# EasyEDA schematic SCH_Breadboard_2022-07-15.json
TITLE: Sheet_1; REV: 1.0; Date: 2022-07-15; Sheet: 1/1; Drawn By: limchengwei; Company: Your Company
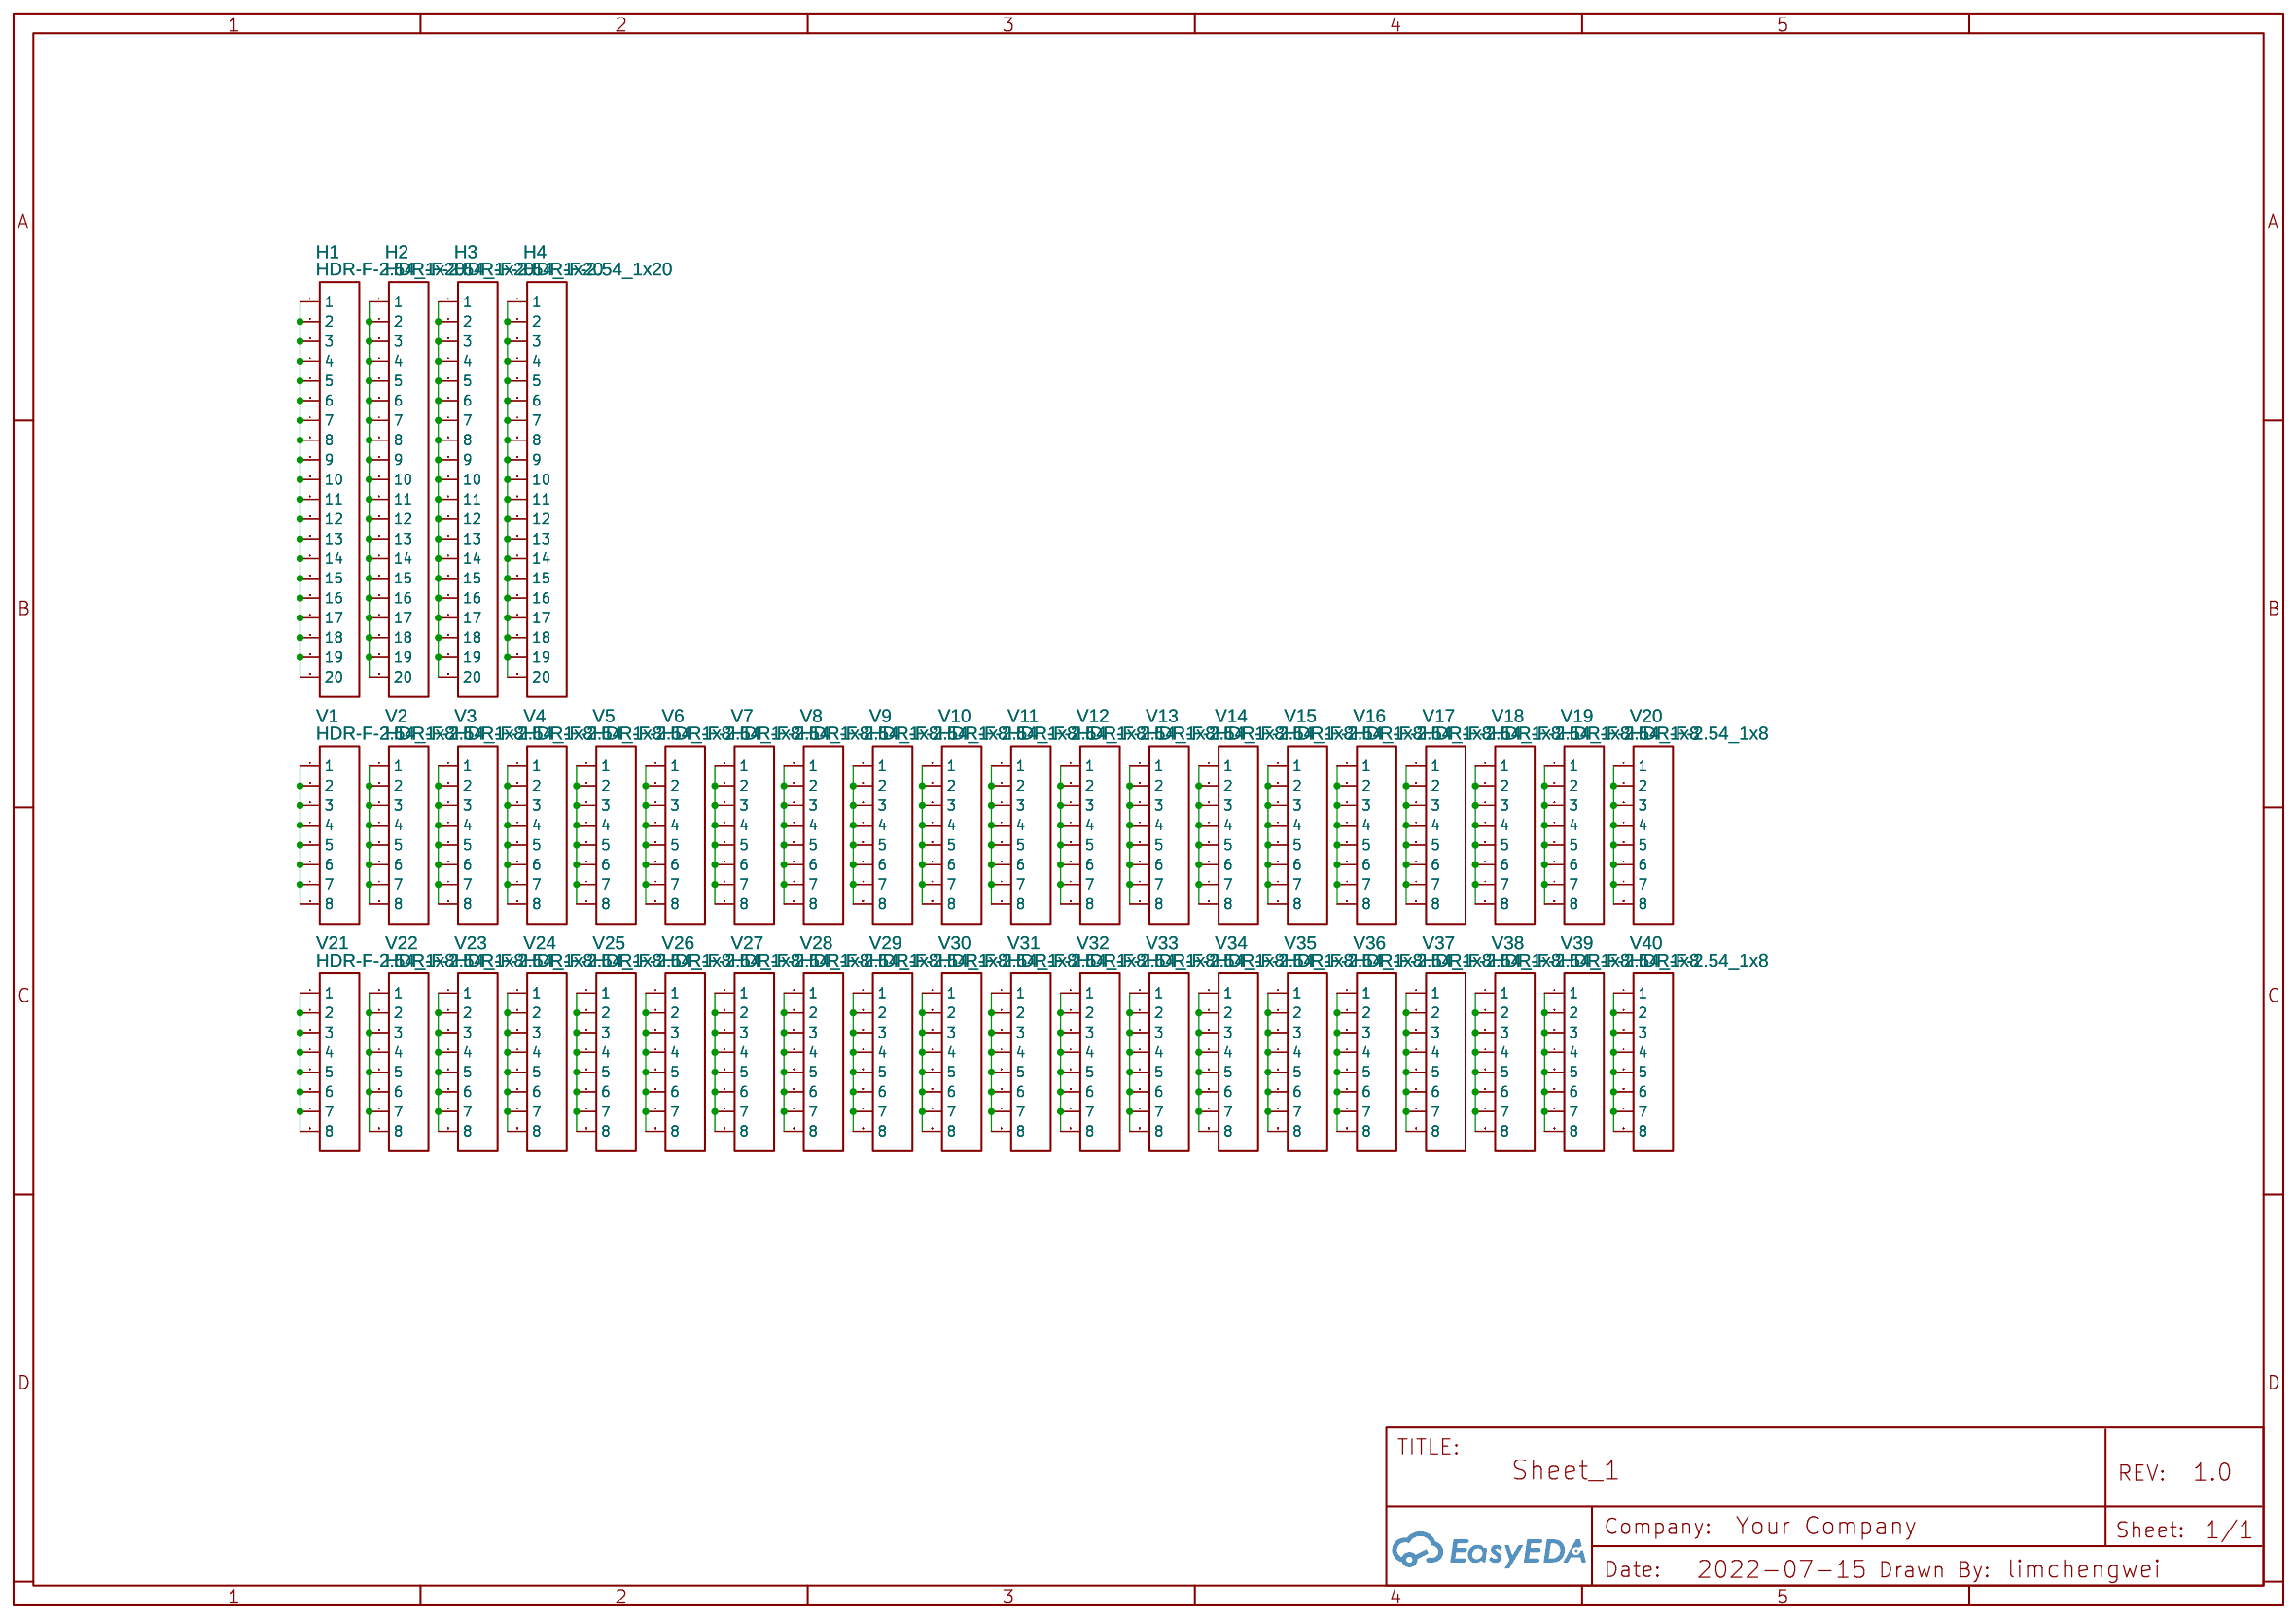
[diagram p0: schematic sheet]

## Parts
H1  HDR-F-2.54_1x20  [HDR-F-2.54_1X20]
H2  HDR-F-2.54_1x20  [HDR-F-2.54_1X20]
H3  HDR-F-2.54_1x20  [HDR-F-2.54_1X20]
H4  HDR-F-2.54_1x20  [HDR-F-2.54_1X20]
V1  HDR-F-2.54_1x8  [HDR-F-2.54_1X8]
V2  HDR-F-2.54_1x8  [HDR-F-2.54_1X8]
V3  HDR-F-2.54_1x8  [HDR-F-2.54_1X8]
V4  HDR-F-2.54_1x8  [HDR-F-2.54_1X8]
V5  HDR-F-2.54_1x8  [HDR-F-2.54_1X8]
V6  HDR-F-2.54_1x8  [HDR-F-2.54_1X8]
V7  HDR-F-2.54_1x8  [HDR-F-2.54_1X8]
V8  HDR-F-2.54_1x8  [HDR-F-2.54_1X8]
V9  HDR-F-2.54_1x8  [HDR-F-2.54_1X8]
V10  HDR-F-2.54_1x8  [HDR-F-2.54_1X8]
V11  HDR-F-2.54_1x8  [HDR-F-2.54_1X8]
V12  HDR-F-2.54_1x8  [HDR-F-2.54_1X8]
V13  HDR-F-2.54_1x8  [HDR-F-2.54_1X8]
V14  HDR-F-2.54_1x8  [HDR-F-2.54_1X8]
V15  HDR-F-2.54_1x8  [HDR-F-2.54_1X8]
V16  HDR-F-2.54_1x8  [HDR-F-2.54_1X8]
V17  HDR-F-2.54_1x8  [HDR-F-2.54_1X8]
V18  HDR-F-2.54_1x8  [HDR-F-2.54_1X8]
V19  HDR-F-2.54_1x8  [HDR-F-2.54_1X8]
V20  HDR-F-2.54_1x8  [HDR-F-2.54_1X8]
V21  HDR-F-2.54_1x8  [HDR-F-2.54_1X8]
V22  HDR-F-2.54_1x8  [HDR-F-2.54_1X8]
V23  HDR-F-2.54_1x8  [HDR-F-2.54_1X8]
V24  HDR-F-2.54_1x8  [HDR-F-2.54_1X8]
V25  HDR-F-2.54_1x8  [HDR-F-2.54_1X8]
V26  HDR-F-2.54_1x8  [HDR-F-2.54_1X8]
V27  HDR-F-2.54_1x8  [HDR-F-2.54_1X8]
V28  HDR-F-2.54_1x8  [HDR-F-2.54_1X8]
V29  HDR-F-2.54_1x8  [HDR-F-2.54_1X8]
V30  HDR-F-2.54_1x8  [HDR-F-2.54_1X8]
V31  HDR-F-2.54_1x8  [HDR-F-2.54_1X8]
V32  HDR-F-2.54_1x8  [HDR-F-2.54_1X8]
V33  HDR-F-2.54_1x8  [HDR-F-2.54_1X8]
V34  HDR-F-2.54_1x8  [HDR-F-2.54_1X8]
V35  HDR-F-2.54_1x8  [HDR-F-2.54_1X8]
V36  HDR-F-2.54_1x8  [HDR-F-2.54_1X8]
V37  HDR-F-2.54_1x8  [HDR-F-2.54_1X8]
V38  HDR-F-2.54_1x8  [HDR-F-2.54_1X8]
V39  HDR-F-2.54_1x8  [HDR-F-2.54_1X8]
V40  HDR-F-2.54_1x8  [HDR-F-2.54_1X8]

## Library data of the parts
H1-H4 = HDR-F-2.54_1x20: Supplier Part: C50984; Supplier: LCSC; Contributor: LCEDA_Lib
V1-V40 = HDR-F-2.54_1x8: Supplier Part: C225505; Supplier: LCSC; Contributor: LCEDA_Lib

## Nets
Net-(H1-1): H1.1 H1.2 H1.3 H1.4 H1.5 H1.6 H1.7 H1.8 H1.9 H1.10 H1.11 H1.12 H1.13 H1.14 H1.15 H1.16 H1.17 H1.18 H1.19 H1.20
Net-(H2-1): H2.1 H2.2 H2.3 H2.4 H2.5 H2.6 H2.7 H2.8 H2.9 H2.10 H2.11 H2.12 H2.13 H2.14 H2.15 H2.16 H2.17 H2.18 H2.19 H2.20
Net-(H3-1): H3.1 H3.2 H3.3 H3.4 H3.5 H3.6 H3.7 H3.8 H3.9 H3.10 H3.11 H3.12 H3.13 H3.14 H3.15 H3.16 H3.17 H3.18 H3.19 H3.20
Net-(H4-1): H4.1 H4.2 H4.3 H4.4 H4.5 H4.6 H4.7 H4.8 H4.9 H4.10 H4.11 H4.12 H4.13 H4.14 H4.15 H4.16 H4.17 H4.18 H4.19 H4.20
Net-(V1-1): V1.1 V1.2 V1.3 V1.4 V1.5 V1.6 V1.7 V1.8
Net-(V2-1): V2.1 V2.2 V2.3 V2.4 V2.5 V2.6 V2.7 V2.8
Net-(V3-1): V3.1 V3.2 V3.3 V3.4 V3.5 V3.6 V3.7 V3.8
Net-(V4-1): V4.1 V4.2 V4.3 V4.4 V4.5 V4.6 V4.7 V4.8
Net-(V5-1): V5.1 V5.2 V5.3 V5.4 V5.5 V5.6 V5.7 V5.8
Net-(V6-1): V6.1 V6.2 V6.3 V6.4 V6.5 V6.6 V6.7 V6.8
Net-(V7-1): V7.1 V7.2 V7.3 V7.4 V7.5 V7.6 V7.7 V7.8
Net-(V8-1): V8.1 V8.2 V8.3 V8.4 V8.5 V8.6 V8.7 V8.8
Net-(V9-1): V9.1 V9.2 V9.3 V9.4 V9.5 V9.6 V9.7 V9.8
Net-(V10-1): V10.1 V10.2 V10.3 V10.4 V10.5 V10.6 V10.7 V10.8
Net-(V11-1): V11.1 V11.2 V11.3 V11.4 V11.5 V11.6 V11.7 V11.8
Net-(V12-1): V12.1 V12.2 V12.3 V12.4 V12.5 V12.6 V12.7 V12.8
Net-(V13-1): V13.1 V13.2 V13.3 V13.4 V13.5 V13.6 V13.7 V13.8
Net-(V14-1): V14.1 V14.2 V14.3 V14.4 V14.5 V14.6 V14.7 V14.8
Net-(V15-1): V15.1 V15.2 V15.3 V15.4 V15.5 V15.6 V15.7 V15.8
Net-(V16-1): V16.1 V16.2 V16.3 V16.4 V16.5 V16.6 V16.7 V16.8
Net-(V17-1): V17.1 V17.2 V17.3 V17.4 V17.5 V17.6 V17.7 V17.8
Net-(V18-1): V18.1 V18.2 V18.3 V18.4 V18.5 V18.6 V18.7 V18.8
Net-(V19-1): V19.1 V19.2 V19.3 V19.4 V19.5 V19.6 V19.7 V19.8
Net-(V20-1): V20.1 V20.2 V20.3 V20.4 V20.5 V20.6 V20.7 V20.8
Net-(V21-1): V21.1 V21.2 V21.3 V21.4 V21.5 V21.6 V21.7 V21.8
Net-(V22-1): V22.1 V22.2 V22.3 V22.4 V22.5 V22.6 V22.7 V22.8
Net-(V23-1): V23.1 V23.2 V23.3 V23.4 V23.5 V23.6 V23.7 V23.8
Net-(V24-1): V24.1 V24.2 V24.3 V24.4 V24.5 V24.6 V24.7 V24.8
Net-(V25-1): V25.1 V25.2 V25.3 V25.4 V25.5 V25.6 V25.7 V25.8
Net-(V26-1): V26.1 V26.2 V26.3 V26.4 V26.5 V26.6 V26.7 V26.8
Net-(V27-1): V27.1 V27.2 V27.3 V27.4 V27.5 V27.6 V27.7 V27.8
Net-(V28-1): V28.1 V28.2 V28.3 V28.4 V28.5 V28.6 V28.7 V28.8
Net-(V29-1): V29.1 V29.2 V29.3 V29.4 V29.5 V29.6 V29.7 V29.8
Net-(V30-1): V30.1 V30.2 V30.3 V30.4 V30.5 V30.6 V30.7 V30.8
Net-(V31-1): V31.1 V31.2 V31.3 V31.4 V31.5 V31.6 V31.7 V31.8
Net-(V32-1): V32.1 V32.2 V32.3 V32.4 V32.5 V32.6 V32.7 V32.8
Net-(V33-1): V33.1 V33.2 V33.3 V33.4 V33.5 V33.6 V33.7 V33.8
Net-(V34-1): V34.1 V34.2 V34.3 V34.4 V34.5 V34.6 V34.7 V34.8
Net-(V35-1): V35.1 V35.2 V35.3 V35.4 V35.5 V35.6 V35.7 V35.8
Net-(V36-1): V36.1 V36.2 V36.3 V36.4 V36.5 V36.6 V36.7 V36.8
Net-(V37-1): V37.1 V37.2 V37.3 V37.4 V37.5 V37.6 V37.7 V37.8
Net-(V38-1): V38.1 V38.2 V38.3 V38.4 V38.5 V38.6 V38.7 V38.8
Net-(V39-1): V39.1 V39.2 V39.3 V39.4 V39.5 V39.6 V39.7 V39.8
Net-(V40-1): V40.1 V40.2 V40.3 V40.4 V40.5 V40.6 V40.7 V40.8
